# Altium schematic sheet SFPGA_power.SchDoc: System FPGA
size 297 x 209 mm; CheckedBy: T.Janicki; CompanyName: Creotech Instruments SA; DrawnBy: G.Kasprowicz; Organization: CERN; Address1: European Organization for Nuclear Research; Address2: CH-1211 Geneve 23 - Switzerland; DocumentNumber: 9; Revision: -; SheetNumber: 9; SheetTotal: 17; EDA_Number: EDA-xxxx; Projet: Simple VME FMC Carrier; ModifiedBy: TW, MC; CreateDate: 20/11/2012; CheckedDate: 23/01/2012; Title2: Power supplies; DivGrp: BE-CO; Designer: G.Kasprowicz; DocumentName: fpga_power.SchDoc; ModifiedDate: -
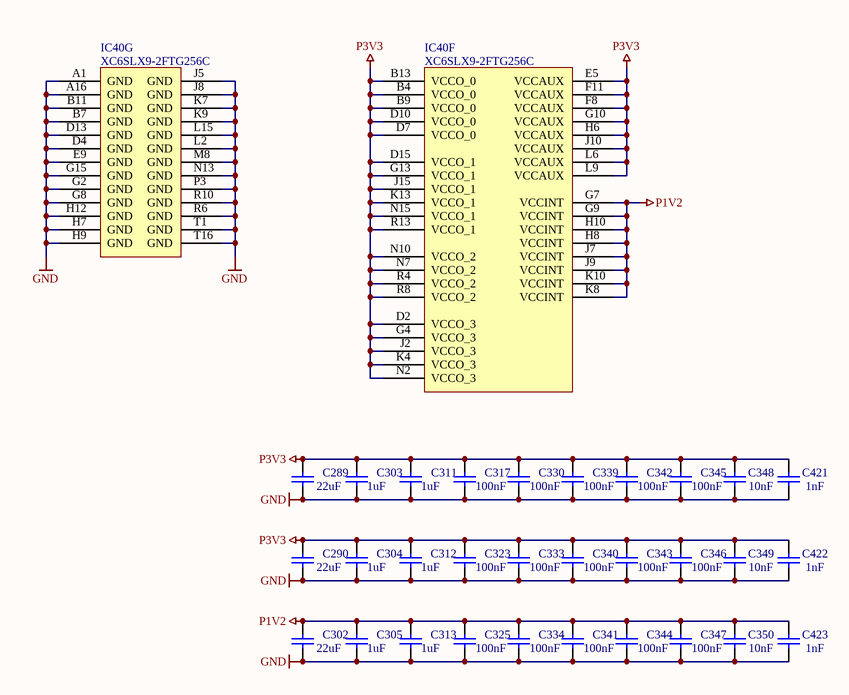
[diagram p0: SFPGA_power.SchDoc]

## Parts
C289  22uF  [CAPC3216X180N]
C290  22uF  [CAPC3216X180N]
C302  22uF  [CAPC3216X180N]
C303  1uF  [CAPC1608X87N]
C304  1uF  [CAPC1608X87N]
C305  1uF  [CAPC1608X87N]
C311  1uF  [CAPC1608X87N]
C312  1uF  [CAPC1608X87N]
C313  1uF  [CAPC1608X87N]
C317  100nF  [CAPC1005X55N]
C323  100nF  [CAPC1005X55N]
C325  100nF  [CAPC1005X55N]
C330  100nF  [CAPC1005X55N]
C333  100nF  [CAPC1005X55N]
C334  100nF  [CAPC1005X55N]
C339  100nF  [CAPC1005X55N]
C340  100nF  [CAPC1005X55N]
C341  100nF  [CAPC1005X55N]
C342  100nF  [CAPC1005X55N]
C343  100nF  [CAPC1005X55N]
C344  100nF  [CAPC1005X55N]
C345  100nF  [CAPC1005X55N]
C346  100nF  [CAPC1005X55N]
C347  100nF  [CAPC1005X55N]
C348  10nF  [CAPC1608X87N]
C349  10nF  [CAPC1608X87N]
C350  10nF  [CAPC1608X87N]
C421  1nF  [CAPC1005X55N]
C422  1nF  [CAPC1005X55N]
C423  1nF  [CAPC1005X55N]
IC40  XC6SLX9-2FTG256C  [BGA256C100P16X16_1700X1700X155]  (parts F,G of 7)

## Nets
GND: C289.1 C290.1 C302.1 C303.1 C304.1 C305.1 C311.1 C312.1 C313.1 C317.1 C323.1 C325.1 C330.1 C333.1 C334.1 C339.1 C340.1 C341.1 C342.1 C343.1 C344.1 C345.1 C346.1 C347.1 C348.1 C349.1 C350.1 C421.1 C422.1 C423.1 IC40.A1(GND) IC40.A16(GND) IC40.B7(GND) IC40.B11(GND) IC40.D4(GND) IC40.D13(GND) IC40.E9(GND) IC40.G2(GND) IC40.G8(GND) IC40.G15(GND) IC40.H7(GND) IC40.H9(GND) IC40.H12(GND) IC40.J5(GND) IC40.J8(GND) IC40.K7(GND) IC40.K9(GND) IC40.L2(GND) IC40.L15(GND) IC40.M8(GND) IC40.N13(GND) IC40.P3(GND) IC40.R6(GND) IC40.R10(GND) IC40.T1(GND) IC40.T16(GND)
P1V2: C302.2 C305.2 C313.2 C325.2 C334.2 C341.2 C344.2 C347.2 C350.2 C423.2 IC40.G7(VCCINT) IC40.G9(VCCINT) IC40.H8(VCCINT) IC40.H10(VCCINT) IC40.J7(VCCINT) IC40.J9(VCCINT) IC40.K8(VCCINT) IC40.K10(VCCINT)
P3V3: C289.2 C290.2 C303.2 C304.2 C311.2 C312.2 C317.2 C323.2 C330.2 C333.2 C339.2 C340.2 C342.2 C343.2 C345.2 C346.2 C348.2 C349.2 C421.2 C422.2 IC40.B4(VCCO_0) IC40.B9(VCCO_0) IC40.B13(VCCO_0) IC40.D2(VCCO_3) IC40.D7(VCCO_0) IC40.D10(VCCO_0) IC40.D15(VCCO_1) IC40.E5(VCCAUX) IC40.F8(VCCAUX) IC40.F11(VCCAUX) IC40.G4(VCCO_3) IC40.G10(VCCAUX) IC40.G13(VCCO_1) IC40.H6(VCCAUX) IC40.J2(VCCO_3) IC40.J10(VCCAUX) IC40.J15(VCCO_1) IC40.K4(VCCO_3) IC40.K13(VCCO_1) IC40.L6(VCCAUX) IC40.L9(VCCAUX) IC40.N2(VCCO_3) IC40.N7(VCCO_2) IC40.N10(VCCO_2) IC40.N15(VCCO_1) IC40.R4(VCCO_2) IC40.R8(VCCO_2) IC40.R13(VCCO_1)

## Notes on the sheet
- Project/Equipment
- Document
- Designer
- Drawn by
- Check.by
- File
- Last Mod.
- Print Date
- Sheet
- Size
- A4
- of
- Rev

## Library data of the parts
C289 C290 C302 = CC1206_22UF_10V_10%_X7R: Non-polarised capacitor; Part Description: SMD Multilayer Chip Ceramic Capacitor; Manufacturer: GENERIC; Manufacturer1 Part Number: GRM31CR71A226KE15L; Voltage: 10V; TC: X7R; Tolerance: ±10%; Table: Capacitors SMD; Part Number: CC1206_22UF_10V_10%_X7R; Component Kind: Standard; Component Type: Standard; Pin Count: 2; Value: 22uF; Status: Preferred; Manufacturer Part Number: CC1206_22UF_10V_10%_X7R; Case: 1206; Mounted: Yes; Socket: No; SMD: Yes; Manufacturer1 Example: MURATA; Manufacturer1 ComponentHeight: 1.8mm; HelpURL: \\cern.ch\dfs\Applications\Altium\Datasheets\CC1206_X7R_MURATA_GRM-HI-CAP.pdf; Author: CERN DEM JLC; CreateDate: 2010-06-08; LatestRevisionDate: 2010-06-08
C303-C305 C311-C313 = CC0603_1UF_16V_10%_X7R: Non-polarised capacitor; Part Description: SMD Multilayer Chip Ceramic Capacitor; Manufacturer: GENERIC; Manufacturer1 Part Number: 223824613663; Voltage: 16V; TC: X7R; Tolerance: ±10%; Table: Capacitors SMD; Part Number: CC0603_1UF_16V_10%_X7R; Component Kind: Standard; Component Type: Standard; Pin Count: 2; Value: 1uF; Status: Preferred; Manufacturer Part Number: CC0603_1uF_16V_10%_X7R; Case: 0603; Mounted: Yes; Socket: No; SMD: Yes; Manufacturer1 Example: PHYCOMP; Manufacturer1 ComponentHeight: 0.87mm; HelpURL: \\cern.ch\dfs\Applications\Altium\Datasheets\CC0805_X5R_PHYCOMP_HC.pdf; Author: CERN DEM JLC; CreateDate: 03/12/2007; LatestRevisionDate: 03/12/2007
C317 C323 C325 C330 C333 C334 C339-C347 = CC0402_100NF_16V_10%_X7R: Non-polarised capacitor; Part Description: SMD Multilayer Chip Ceramic Capacitor; Manufacturer: GENERIC; Manufacturer1 Part Number: 223878715649; Voltage: 16V; TC: X7R; Tolerance: ±10%; Table: Capacitors SMD; Part Number: CC0402_100NF_16V_10%_X7R; Component Kind: Standard; Component Type: Standard; Pin Count: 2; Value: 100nF; Status: Not Recommended; Manufacturer Part Number: CC0402_100NF_16V_10%_X7R; Case: 0402; Mounted: Yes; Socket: No; SMD: Yes; Manufacturer1 Example: PHYCOMP; Manufacturer1 ComponentHeight: 0.55mm; HelpURL: \\cern.ch\dfs\Applications\Altium\Datasheets\CC0402_X7R_PHYCOMP.pdf; Author: CERN DEM JLC; CreateDate: 03/12/2007; LatestRevisionDate: 03/12/2007
C348-C350 = CC0603_10NF_50V_10%_X7R: Non-polarised capacitor; Part Description: SMD Multilayer Chip Ceramic Capacitor; Manufacturer: GENERIC; Manufacturer1 Part Number: 223858615636; Voltage: 50V; TC: X7R; Tolerance: ±10%; Table: Capacitors SMD; Part Number: CC0603_10NF_50V_10%_X7R; Component Kind: Standard; Component Type: Standard; Pin Count: 2; Value: 10nF; Status: Preferred; Manufacturer Part Number: CC0603_10NF_50V_10%_X7R; Case: 0603; Mounted: Yes; Socket: No; SMD: Yes; Manufacturer1 Example: PHYCOMP; Manufacturer1 ComponentHeight: 0.87mm; HelpURL: \\cern.ch\dfs\Applications\Altium\Datasheets\CC0603_X7R_PHYCOMP.pdf; Author: CERN DEM JLC; CreateDate: 03/12/2007; LatestRevisionDate: 03/12/2007
C421-C423 = CC0402_1NF_50V_10%_X7R: Non-polarised capacitor; Part Description: SMD Multilayer Chip Ceramic Capacitor; Manufacturer: GENERIC; Manufacturer1 Part Number: 223858715623; Voltage: 50V; TC: X7R; Tolerance: ±10%; Table: Capacitors SMD; Part Number: CC0402_1NF_50V_10%_X7R; Component Kind: Standard; Component Type: Standard; Pin Count: 2; Value: 1nF; Status: Not Recommended; Manufacturer Part Number: CC0402_1NF_50V_10%_X7R; Case: 0402; Mounted: Yes; Socket: No; SMD: Yes; Manufacturer1 Example: PHYCOMP; Manufacturer1 ComponentHeight: 0.55mm; HelpURL: \\cern.ch\dfs\Applications\Altium\Datasheets\CC0402_X7R_PHYCOMP.pdf; Author: CERN DEM JLC; CreateDate: 03/12/2007; LatestRevisionDate: 03/12/2007
IC40 = XC6SLX9-2FTG256C: Spartan-6 LX 1.2V FPGA, 186 User I/Os, 256-Ball Fine-Pitch Thin BGA (1.0mm Pitch), Speed Grade 2, Commercial Grade, Pb-Free; Manufacturer: XILINX; Table: Logic; Part Number: XC6SLX9-2FTG256C; Component Kind: Standard; Component Type: Standard; Device: XC6SLX9-2FTG256C; PackageDescription: BGA 1mm, Pitch, Square 256 Pin, 16 Columns x 16 Rows, Body 17mm X 17mm X 1.55mm H; Part Description: Spartan-6 LX 1.2V FPGA, 186 User I/Os, 256-Ball Fine-Pitch Thin BGA (1.0mm Pitch), Speed Grade 2, Commercial Grade, Pb-Free; Manufacturer Part Number: XC6SLX9-2FTG256C; Pin Count: 256; Case: BGA256; Mounted: Yes; Socket: No; SMD: Yes; ComponentHeight: 1.55mm; HelpURL: \\cern.ch\dfs\Applications\Altium\Datasheets\XC6SLX9-2FTG256C.pdf; ComponentLink1URL: \\cern.ch\dfs\Applications\Altium\Datasheets\XC6SLX9-2FTG256C_Package-Pinout.pdf; ComponentLink1Description: Package/Pinouts; Author: CERN DEM JLC; CreateDate: 2011-11-01; LatestRevisionDate: 2011-11-01